# EAGLE design SmodSHRR (EAGLE 6.3)
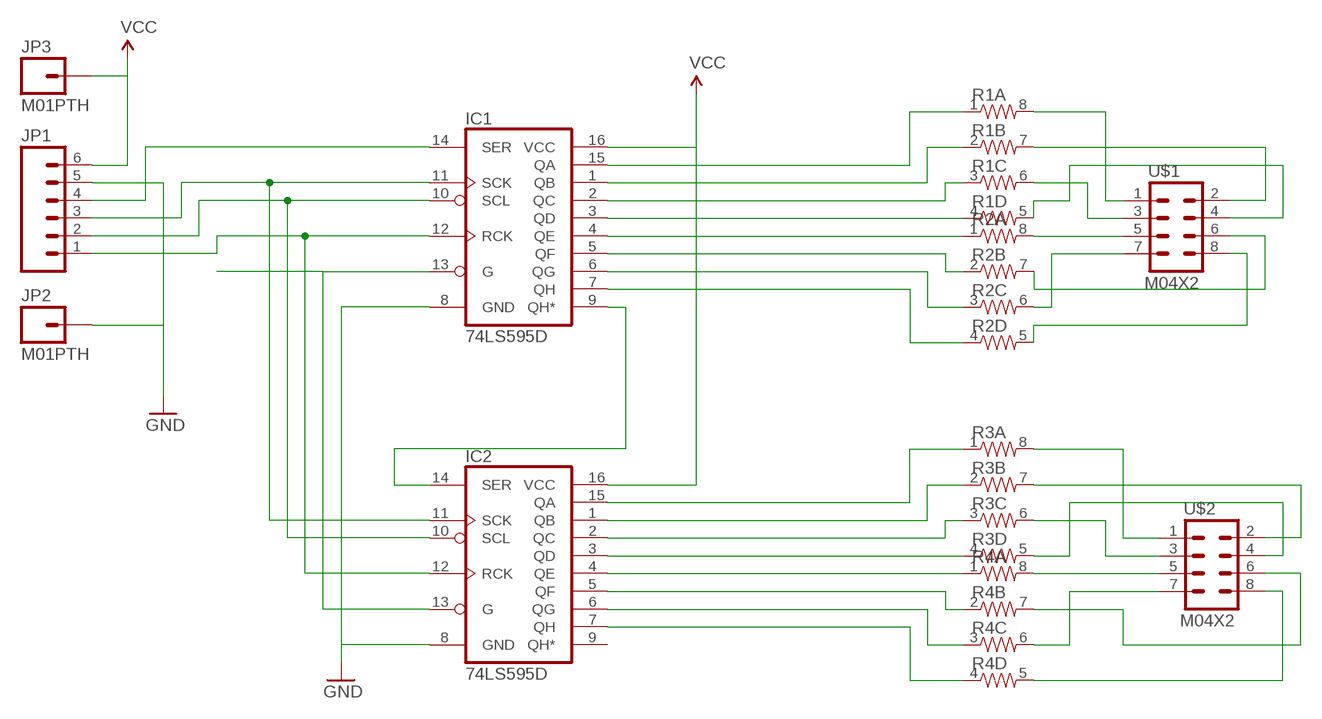
[diagram p0: schematic, sheet 1]

## Parts
IC1  74LS595D  [SO16]
IC2  74LS595D  [SO16]
JP1  M06SIP  [1X06]
JP2  M01PTH  [1X01]
JP3  M01PTH  [1X01]
R1  RESISTOR-ARRAY0603-ARV  [0603-ARV]
R2  RESISTOR-ARRAY0603-ARV  [0603-ARV]
R3  RESISTOR-ARRAY0603-ARV  [0603-ARV]
R4  RESISTOR-ARRAY0603-ARV  [0603-ARV]
U$1  M04X2  [2X4]
U$2  M04X2  [2X4]

## Nets
GND: IC1.8(GND) IC2.8(GND) JP1.5 JP2.1
N$1: IC1.9(QH*) IC2.14(SER)
N$3: IC1.11(SCK) IC2.11(SCK) JP1.3
N$4: IC1.10(SCL) IC2.10(SCL) JP1.2
N$5: IC1.12(RCK) IC2.12(RCK) JP1.1
N$6: R1.8 U$1.1
N$7: R1.7 U$1.2
N$8: IC1.13(G) IC2.13(G)
N$9: IC1.15(QA) R1.1
N$10: IC1.1(QB) R1.2
N$11: IC1.2(QC) R1.3
N$12: IC1.3(QD) R1.4
N$13: IC1.4(QE) R2.1
N$14: IC1.5(QF) R2.2
N$15: IC1.6(QG) R2.3
N$16: IC1.7(QH) R2.4
N$17: IC2.15(QA) R3.1
N$18: IC2.1(QB) R3.2
N$19: IC2.2(QC) R3.3
N$20: IC2.3(QD) R3.4
N$21: IC2.4(QE) R4.1
N$22: IC2.5(QF) R4.2
N$23: IC2.6(QG) R4.3
N$24: IC2.7(QH) R4.4
N$25: R3.8 U$2.1
N$26: R1.6 U$1.3
N$27: R1.5 U$1.4
N$28: R2.8 U$1.5
N$29: R2.7 U$1.6
N$30: R2.6 U$1.7
N$31: R2.5 U$1.8
N$32: R3.7 U$2.2
N$33: R3.6 U$2.3
N$34: R3.5 U$2.4
N$35: R4.8 U$2.5
N$36: R4.7 U$2.6
N$37: R4.6 U$2.7
N$38: R4.5 U$2.8
N$40: IC1.14(SER) JP1.4
VCC: IC1.16(VCC) IC2.16(VCC) JP1.6 JP3.1
Unconnected: IC2.9(QH*)

## Library data of the parts
IC1 IC2 = SparkFun-DigitalIC:74*595: 8-bit SHIFT REGISTER, output latch
JP1 = SparkFun-Connectors:M06: Header 6 Standard 6-pin 0.1" header. Use with straight break away headers (SKU : PRT-00116), right angle break away headers (PRT-00553), swiss pins (PRT-00743), machine pins (PRT-00117), and female headers (PRT-00115). Molex polarized connector foot print use with SKU : PRT-08094 with associated crimp pins and housings. NOTES ON THE VARIANTS LOCK and LOCK_LONGPADS... This footprint was designed to help hold the alignment of a through-hole component (i.e. 6-pin header) while soldering it into place. You may notice that each hole has been shifted either up or down by 0.005 of an inch from it's more standard position (which is a perfectly straight line). This slight alteration caused the pins (the squares in the middle) to touch the edges of the holes. Because they are alternating, it causes a "brace" to hold the component in place. 0.005 has proven to be the perfect amount of "off-center" position when using our standard breakaway headers. Although looks a little odd when you look at the bare footprint, once you have a header in there, the alteration is very hard to notice. Also, if you push a header all the way into place, it is covered up entirely on the bottom side. This idea of altering the position of holes to aid alignment will be further integrated into the Sparkfun Library for other footprints. It can help hold any component with 3 or more connection pins.
JP2 JP3 = SparkFun-Connectors:M01: Header 1 Standard 1-pin 0.1" header. Use with straight break away headers (SKU : PRT-00116), right angle break away headers (PRT-00553), swiss pins (PRT-00743), machine pins (PRT-00117), and female headers (PRT-00115).
R1-R4 = SparkFun-Passives:RESISTOR-ARRAY: Array Chip Resistor Source: RS Component / Phycomp
U$1 U$2 = SparkFun-Connectors:M04X2: .1" header, two rows of four.

## Board
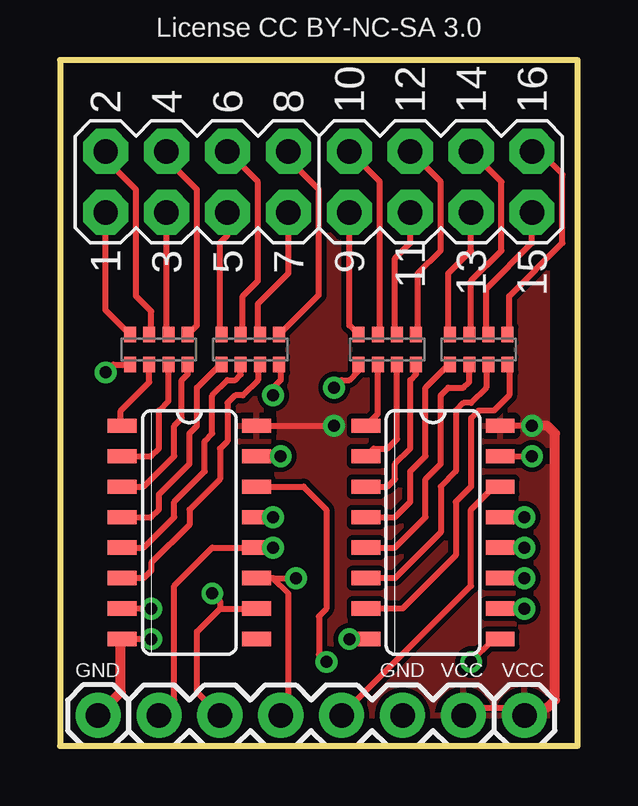
[diagram p1: board, top side]
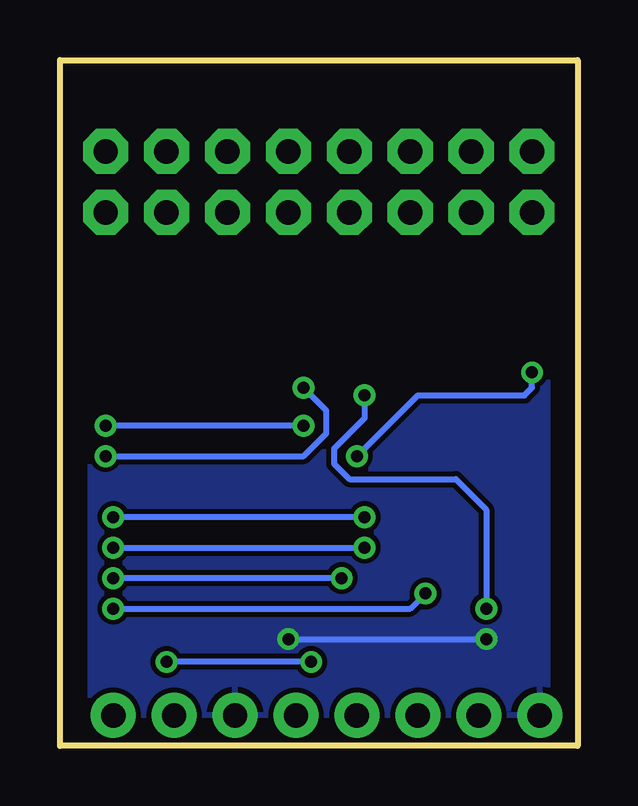
[diagram p2: board, bottom side, seen from below]

Size 21.59 x 28.57 mm. Coordinates in mm from the lower left corner, seen from the top.
Outline: 0,0 21.59,0 21.59,28.57 0,28.57 0,0
Copper layers (1*16): Top 0.035mm / dielectric 1.5mm / Bottom 0.035mm
Design rules "default": minimum track width 10mil, minimum drill 24mil, track to track 8mil, track to pad 8mil, pad to pad 8mil, via to via 8mil, smd to smd 8mil, copper to edge 40mil, drill to drill 8mil, minimum pad ring 10mil, minimum via ring 8mil, stop-mask expansion 4mil, vias tented up to drill 0mil, thermal gap 10mil

### Footprints (pad centres in the part's own frame; a part is rotated, then mirrored left to right if it is on the bottom)
SO16 = smd 0.6 x 1.2: 1 -4.445,-2.8; 2 -3.175,-2.8; 3 -1.905,-2.8; 4 -0.635,-2.8; 5 0.635,-2.8; 6 1.905,-2.8; 7 3.175,-2.8; 8 4.445,-2.8; 9 4.445,2.8; 10 3.175,2.8; 11 1.905,2.8; 12 0.635,2.8; 13 -0.635,2.8; 14 -1.905,2.8; 15 -3.175,2.8; 16 -4.445,2.8
1X06 = drill 1.016 pad 1.88: 1 0,0; 2 2.54,0; 3 5.08,0; 4 7.62,0; 5 10.16,0; 6 12.7,0
1X01 = drill 1.016 pad 1.88: 1 0,0
0603-ARV = smd 0.5 x 0.65: 1 -1.2,-0.625; 2 -0.4,-0.625; 3 0.4,-0.625; 4 1.2,-0.625; 5 1.2,0.625; 6 0.4,0.625; 7 -0.4,0.625; 8 -1.2,0.625
2X4 = drill 1.016 pad 1.88 octagon: 1 -3.81,-1.27; 2 -3.81,1.27; 3 -1.27,-1.27; 4 -1.27,1.27; 5 1.27,-1.27; 6 1.27,1.27; 7 3.81,-1.27; 8 3.81,1.27

### Placement (x,y rotation side)
IC1  15.56,8.89 270 top
IC2  5.4,8.89 270 top
JP1  4.13,1.27 0 top
JP2  1.59,1.27 0 top
JP3  19.37,1.27 0 top
R1  13.65,16.51 0 top
R2  17.46,16.51 0 top
R3  4.13,16.51 0 top
R4  7.94,16.51 0 top
U$1  15.88,23.5 0 top
U$2  5.72,23.5 0 top

### Tracks (layer width: path | path; a pad name or v marks a point on that pad's centre or on a via)
GND  (via drill 0.5 pad 0.25)
  Top 0.254: IC1.8 v12.06,4.45 | v3.81,4.45 IC2.8
  Top 0.406: JP2.1 2.54,2.22 2.54,4.45
  Bottom 0.254: v12.06,4.45 v3.81,4.45
  pour Bottom: 0,0 21.59,0 21.59,28.57 0,28.57
N$1  (via drill 0.5 pad 0.25)
  Top 0.254: IC2.14 10.16,10.79 11.11,9.84 11.11,5.71 10.79,5.4 10.79,3.81 v11.11,3.49 | v17.15,3.49 18.1,4.45 IC1.9
  Bottom 0.254: v11.11,3.49 v17.15,3.49
N$3  (via drill 0.5 pad 0.25)
  Top 0.254: JP1.3 9.52,1.59 9.52,6.35 8.89,6.99 IC2.11 v9.84,6.99 | v19.37,6.99 IC1.11
  Bottom 0.254: v9.84,6.99 v19.37,6.99
N$4  (via drill 0.5 pad 0.25)
  Top 0.254: JP1.2 5.72,2.22 5.72,4.76 6.67,5.71 | 6.67,5.71 IC2.10 | IC1.10 v19.37,5.71 | v6.35,6.35 6.67,6.03 6.67,5.71
  Bottom 0.254: v19.37,5.71 6.99,5.71 v6.35,6.35
N$5  (via drill 0.5 pad 0.25)
  Top 0.254: JP1.1 4.76,1.91 4.76,6.67 6.35,8.26 IC2.12 v8.89,8.26 | IC1.12 v19.37,8.26
  Bottom 0.254: v19.37,8.26 v8.89,8.26
N$6
  Top 0.254: R1.8 12.06,17.52 U$1.1
N$7
  Top 0.254: R1.7 13.34,17.22 13.34,23.5 U$1.2
N$8  (via drill 0.5 pad 0.25)
  Top 0.254: IC2.13 v8.89,9.53 | v19.37,9.53 IC1.13
  Bottom 0.254: v8.89,9.53 v19.37,9.53
N$9  (via drill 0.5 pad 0.25)
  Top 0.254: IC1.15 v19.68,12.06 | v11.43,14.92 11.75,15.24 12.06,15.24 12.45,15.63 R1.1
  Bottom 0.254: v19.68,12.06 11.43,12.06 10.48,13.02 10.48,13.97 v11.43,14.92
N$10
  Top 0.254: IC1.1 13.25,13.83 R1.2
N$11
  Top 0.254: IC1.2 13.08,12.38 13.65,12.38 14.05,12.78 R1.3
N$12
  Top 0.254: IC1.3 13.65,10.79 13.97,11.11 13.97,11.75 14.61,12.38 14.61,15.24 14.85,15.49 R1.4
N$13
  Top 0.254: IC1.4 13.97,9.53 14.61,10.16 14.61,11.43 15.24,12.06 15.24,14.92 16.2,15.88 R2.1
N$14
  Top 0.254: IC1.5 13.97,8.26 15.24,9.53 15.24,11.11 15.88,11.75 15.88,14.61 16.19,14.92 16.83,14.92 17.06,15.16 R2.2
N$15
  Top 0.254: R2.3 17.78,15.8 17.78,14.92 17.15,14.29 16.83,14.29 16.51,13.97 16.51,11.43 15.88,10.79 15.88,8.89 13.97,6.99 IC1.6
N$16
  Top 0.254: R2.4 18.73,15.81 18.73,14.61 18.1,13.97 17.46,13.97 17.15,13.65 17.15,10.79 16.51,10.16 16.51,7.94 14.29,5.71 IC1.7
N$17  (via drill 0.5 pad 0.25)
  Top 0.254: IC2.15 v9.21,12.06 | v1.91,15.56 2.23,15.88 R3.1
  Bottom 0.254: v9.21,12.06 6.67,14.61 2.22,14.61 1.91,14.92 v1.91,15.56
N$18
  Top 0.254: IC2.1 2.54,13.39 2.54,13.97 3.73,15.16 R3.2
N$19
  Top 0.254: IC2.2 3.81,12.06 4.13,12.38 4.13,13.97 4.53,14.37 R3.3
N$20
  Top 0.254: IC2.3 3.49,10.79 4.76,12.06 4.76,13.34 5.08,13.65 5.08,15.24 5.33,15.49 R3.4
N$21
  Top 0.254: IC2.4 3.81,9.53 4.13,9.84 4.13,10.48 5.4,11.75 5.4,13.02 5.72,13.34 5.72,14.92 6.68,15.88 R4.1
N$22
  Top 0.254: IC2.5 3.49,8.26 4.76,9.53 4.76,10.16 6.03,11.43 6.03,12.7 6.35,13.02 6.35,14.61 6.99,15.24 7.3,15.24 7.54,15.47 R4.2
N$23
  Top 0.254: R4.3 8.25,15.8 8.25,15.24 7.62,14.61 7.3,14.61 6.99,14.29 6.99,12.7 6.67,12.38 6.67,11.11 5.4,9.84 5.4,9.21 3.81,7.62 3.81,7.3 3.49,6.99 IC2.6
N$24  (via drill 0.5 pad 0.25)
  Top 0.254: R4.4 9.21,15.81 9.21,15.24 8.89,14.92 v8.89,14.61 | v3.81,5.71 IC2.7
  Bottom 0.254: v8.89,14.61 8.89,13.65 10.16,12.38 10.16,11.75 9.52,11.11 5.08,11.11 3.81,9.84 v3.81,5.71
N$25
  Top 0.254: R3.8 1.91,18.16 U$2.1
N$26
  Top 0.254: R1.6 13.97,17.22 13.97,20.32 14.61,20.95 U$1.3
N$27
  Top 0.254: R1.5 14.92,17.2 14.92,19.68 15.88,20.64 15.88,23.5 U$1.4
N$28
  Top 0.254: R2.8 16.19,17.2 16.19,19.68 17.15,20.64 U$1.5
N$29
  Top 0.254: R2.7 17.15,17.22 17.15,19.37 18.41,20.64 18.41,23.5 U$1.6
N$30
  Top 0.254: R2.6 17.78,17.22 17.78,19.05 19.68,20.95 U$1.7
N$31
  Top 0.254: R2.5 18.73,17.2 18.73,18.73 20.95,20.95 20.95,23.81 20,24.77 U$1.8
N$32
  Top 0.254: R3.7 3.81,17.22 3.81,18.1 3.17,18.73 3.17,23.18 1.91,24.45 U$2.2
N$33
  Top 0.254: R3.6 4.44,17.22 U$2.3
N$34
  Top 0.254: R3.5 5.72,17.52 5.72,23.18 4.44,24.45 U$2.4
N$35
  Top 0.254: R4.8 6.67,17.2 6.67,20.95 6.99,21.27 U$2.5
N$36
  Top 0.254: R4.7 7.62,17.22 7.62,18.73 8.25,19.37 8.25,23.5 U$2.6
N$37
  Top 0.254: R4.6 8.25,17.22 8.25,18.41 9.52,19.68 U$2.7
N$38
  Top 0.254: R4.5 10.79,18.79 10.79,23.18 9.52,24.45 U$2.8
N$40
  Top 0.254: JP1.4 17.15,6.67 17.15,9.84 18.1,10.79 IC1.14
VCC  (via drill 0.5 pad 0.25)
  Top 0.254: IC2.16 v11.43,13.34 | v19.68,13.34 IC1.16 | JP1.6 17.15,1.59 20.32,1.59
  Top 0.406: 20.32,1.59 20.64,1.91 20.64,13.02 20.32,13.34 v19.68,13.34
  Bottom 0.254: v11.43,13.34 v19.68,13.34
  pour Top: 0,0 21.59,0 21.59,28.57 0,28.57

### Text on the board
_tsilk: Made by Shannon Strutz / For the University of Wisconsin - Stout / 2013 / / License CC BY-NC-SA 3.0 | 2 | 4 | 6 | 8 | 10 | 12 | 14 | 16 | 1 | 3 | 5 | 7 | 9 | 11 | 13 | 15 | GND | GND | VCC | VCC